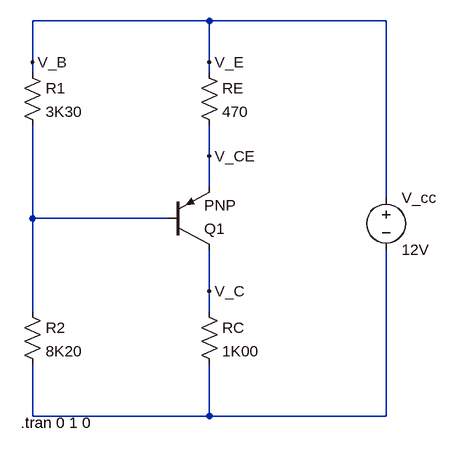
[diagram p0: schematic transistor_circuit.asc]
transistor_circuit.asc, the LTspice schematic file:
Version 4
SHEET 1 880 680
WIRE 240 -176 -32 -176
WIRE 512 -176 240 -176
WIRE -32 -112 -32 -176
WIRE 240 -112 240 -176
WIRE -32 -96 -32 -112
WIRE 240 -96 240 -112
WIRE 240 32 240 -16
WIRE 240 80 240 32
WIRE 512 96 512 -176
WIRE -32 128 -32 -16
WIRE 176 128 -32 128
WIRE 240 240 240 176
WIRE -32 272 -32 128
WIRE 240 272 240 240
WIRE -32 432 -32 352
WIRE 240 432 240 352
WIRE 240 432 -32 432
WIRE 512 432 512 176
WIRE 512 432 240 432
FLAG 240 -112 V_E
FLAG -32 -112 V_B
FLAG 240 240 V_C
FLAG 240 32 V_CE
SYMBOL pnp 176 176 M180
SYMATTR InstName Q1
SYMBOL res 224 -112 R0
SYMATTR InstName RE
SYMATTR Value 470
SYMBOL res 224 256 R0
SYMATTR InstName RC
SYMATTR Value 1K00
SYMBOL res -48 256 R0
SYMATTR InstName R2
SYMATTR Value 8K20
SYMBOL res -48 -112 R0
SYMATTR InstName R1
SYMATTR Value 3K30
SYMBOL voltage 512 80 R0
WINDOW 123 0 0 Left 0
WINDOW 39 0 0 Left 0
SYMATTR InstName V_cc
SYMATTR Value 12V
TEXT -50 442 Left 2 !.tran 0 1 0

The netlist it stands for:
* transistor_circuit.asc
Q1 V_C N001 V_CE 0 PNP
RE V_B V_CE 470
RC V_C N002 1K00
R2 N001 N002 8K20
R1 V_B N001 3K30
V_cc V_B N002 12V
.model NPN NPN
.model PNP PNP
.lib standard.bjt
.tran 0 1 0
.backanno
.end